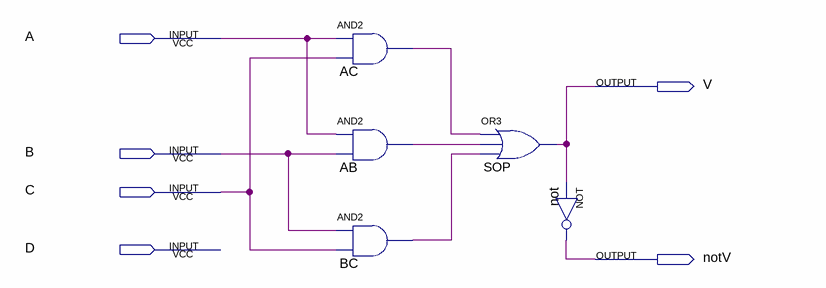
[diagram p0: schematic sheet]
// Quartus schematic d1-1.bdf as structural Verilog: 5 symbols, 6 pins
module \d1-1  (
  input  A,
  input  B,
  input  C,
  input  D,
  output V,
  output notV
);

  wire AB_out, AC_out, BC_out;

  and AC (AC_out, A, C);
  and AB (AB_out, A, B);
  and BC (BC_out, B, C);
  or SOP (V, AC_out, AB_out, BC_out);
  not \not  (notV, V);
endmodule
